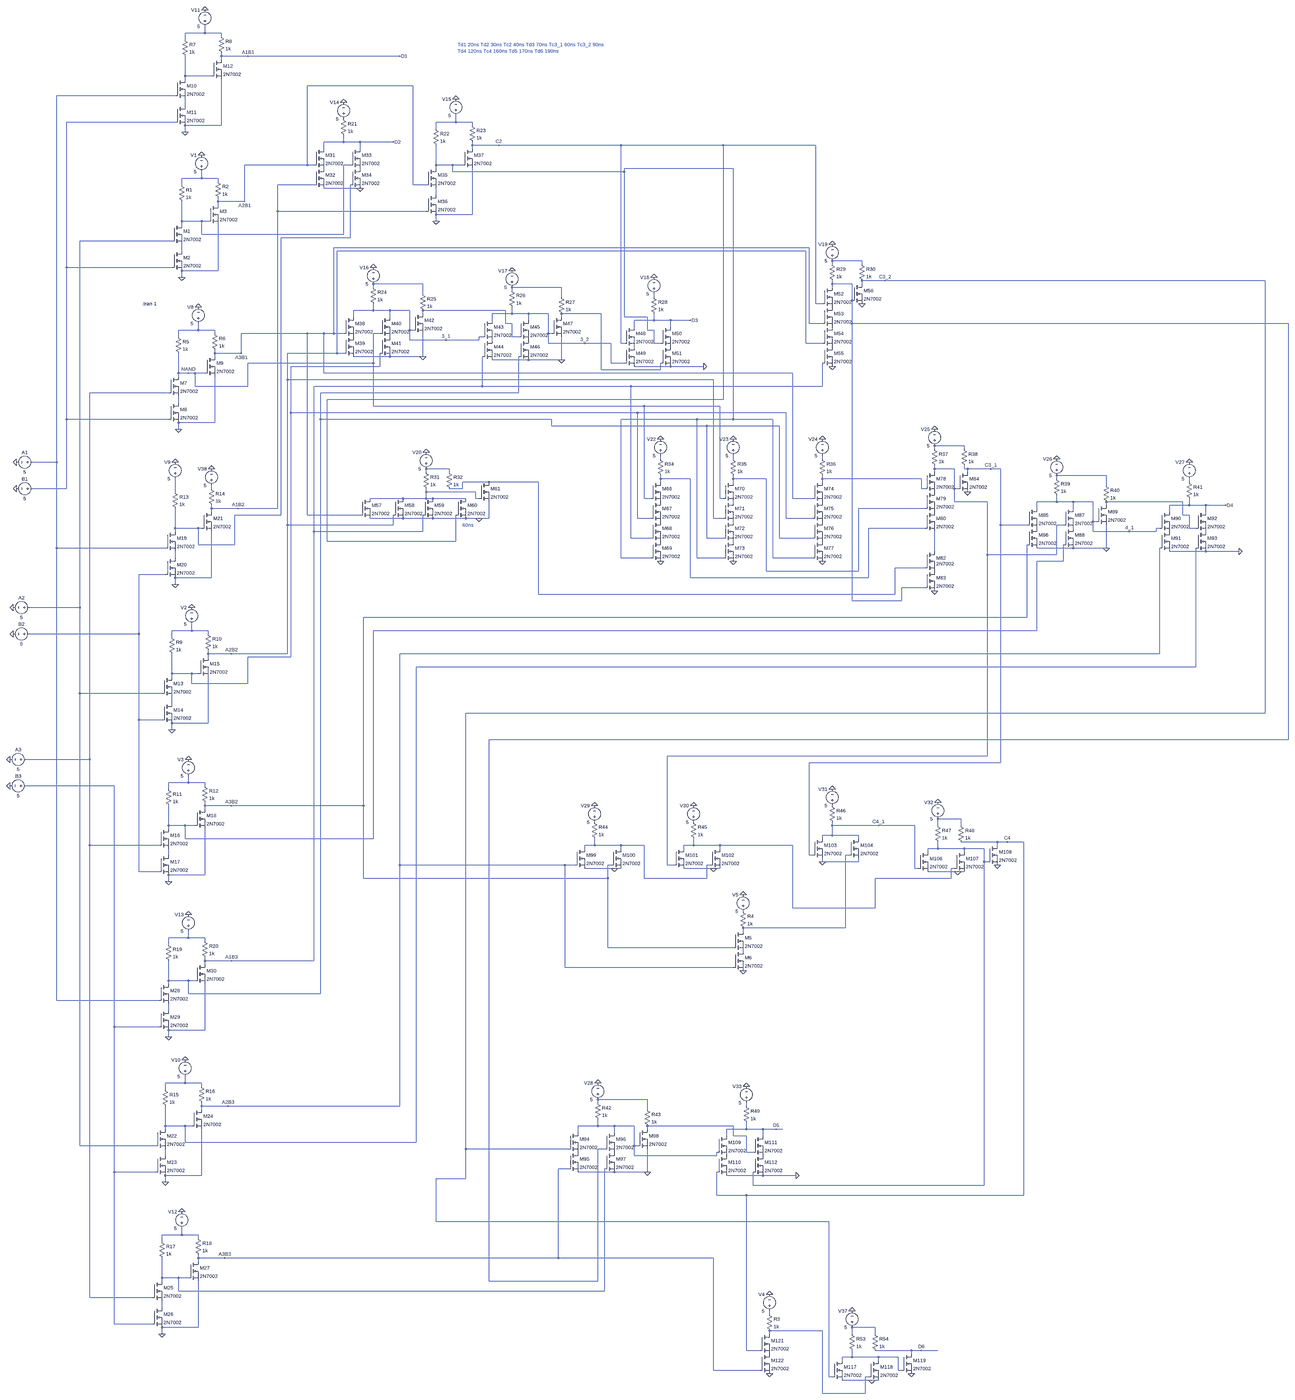
[diagram p0: schematic MOSFET Testing.asc, whole sheet]
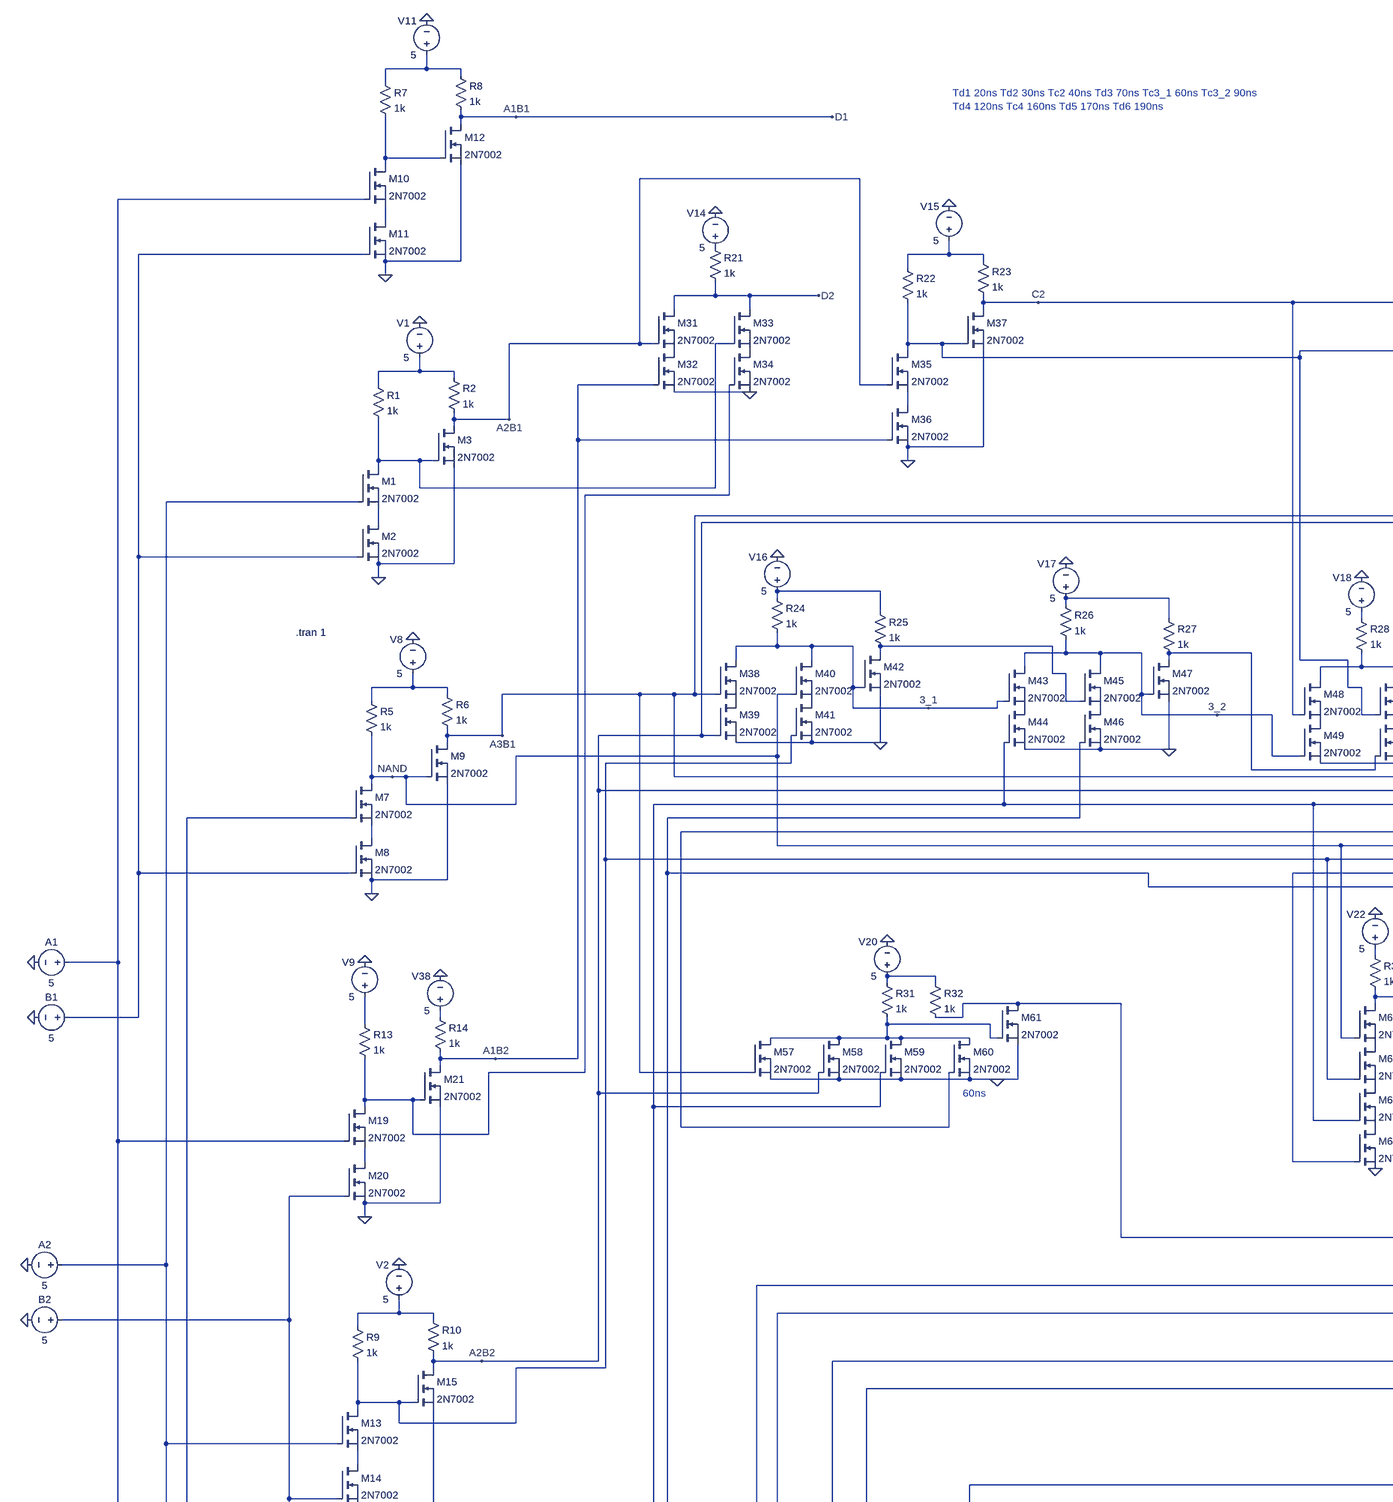
[diagram p1: schematic MOSFET Testing.asc, part, row 1 of 2, column 1 of 2]
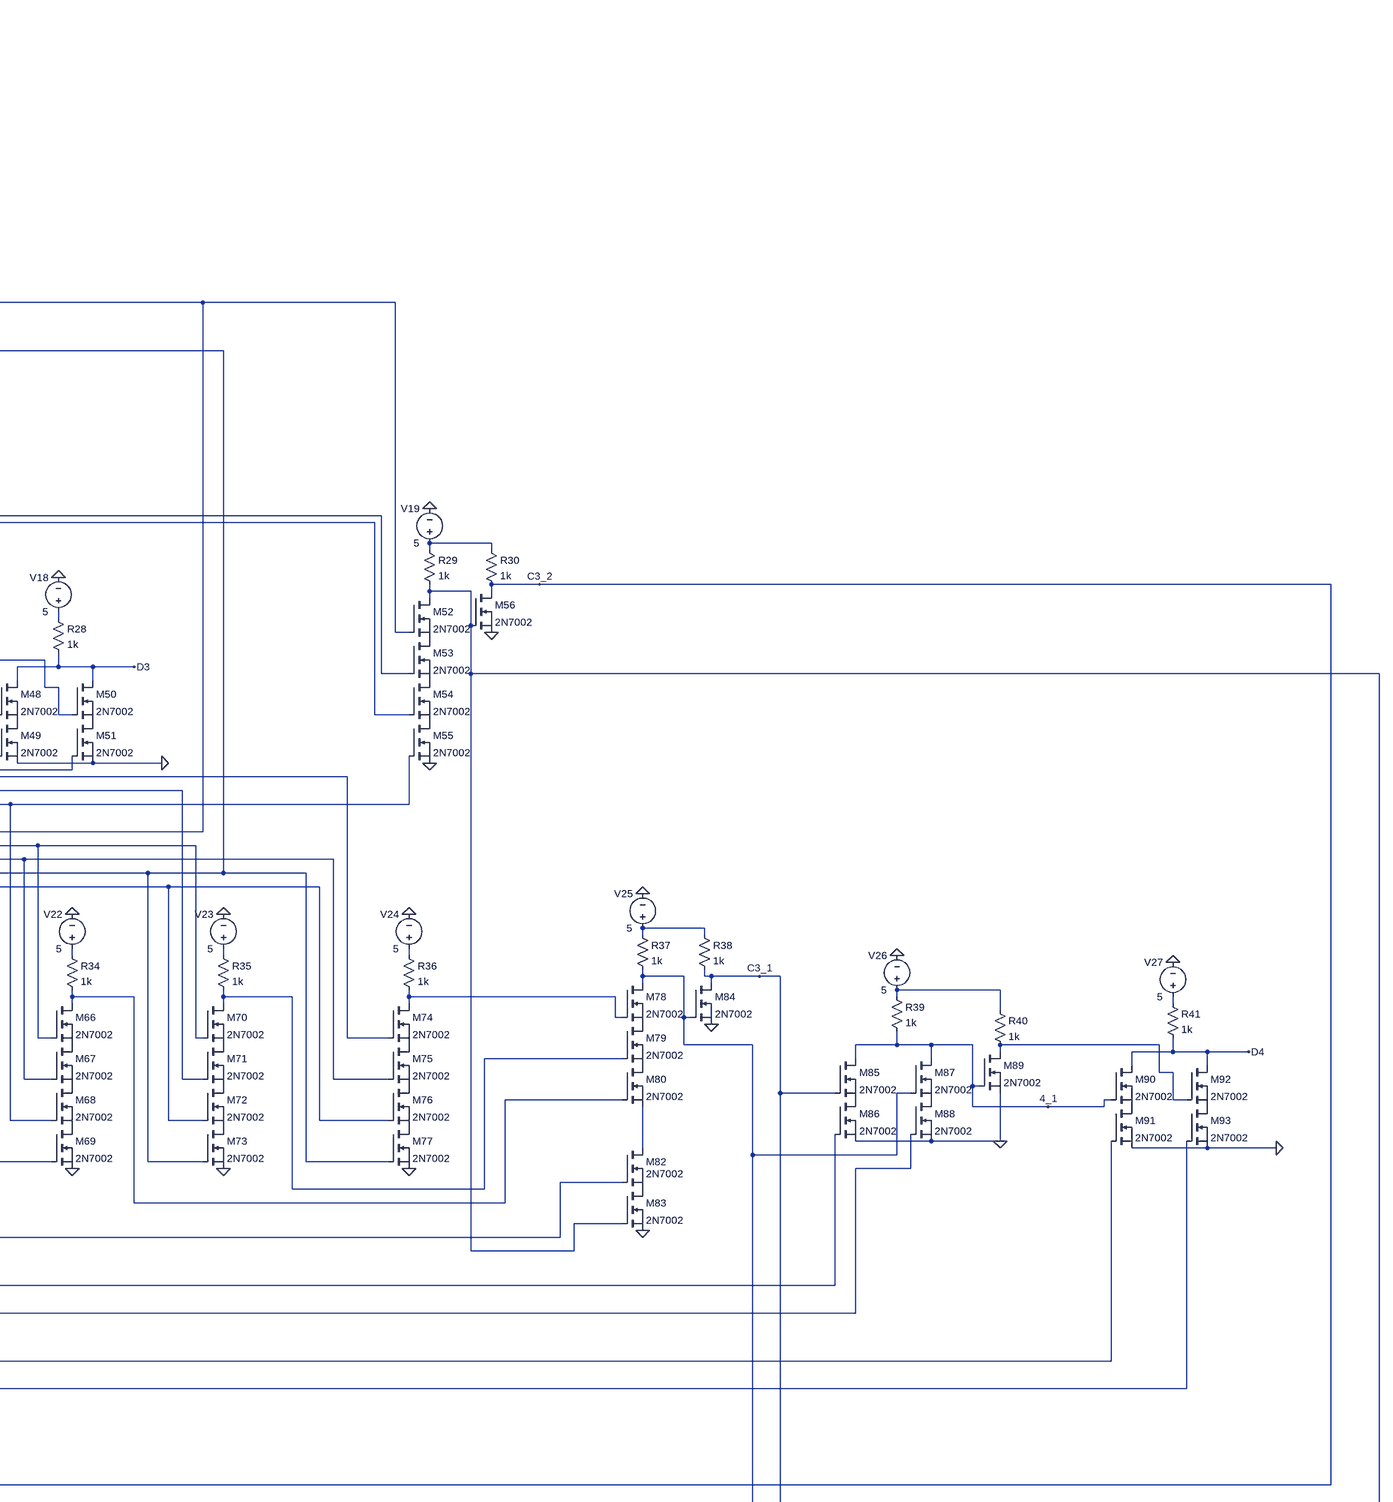
[diagram p2: schematic MOSFET Testing.asc, part, row 1 of 2, column 2 of 2]
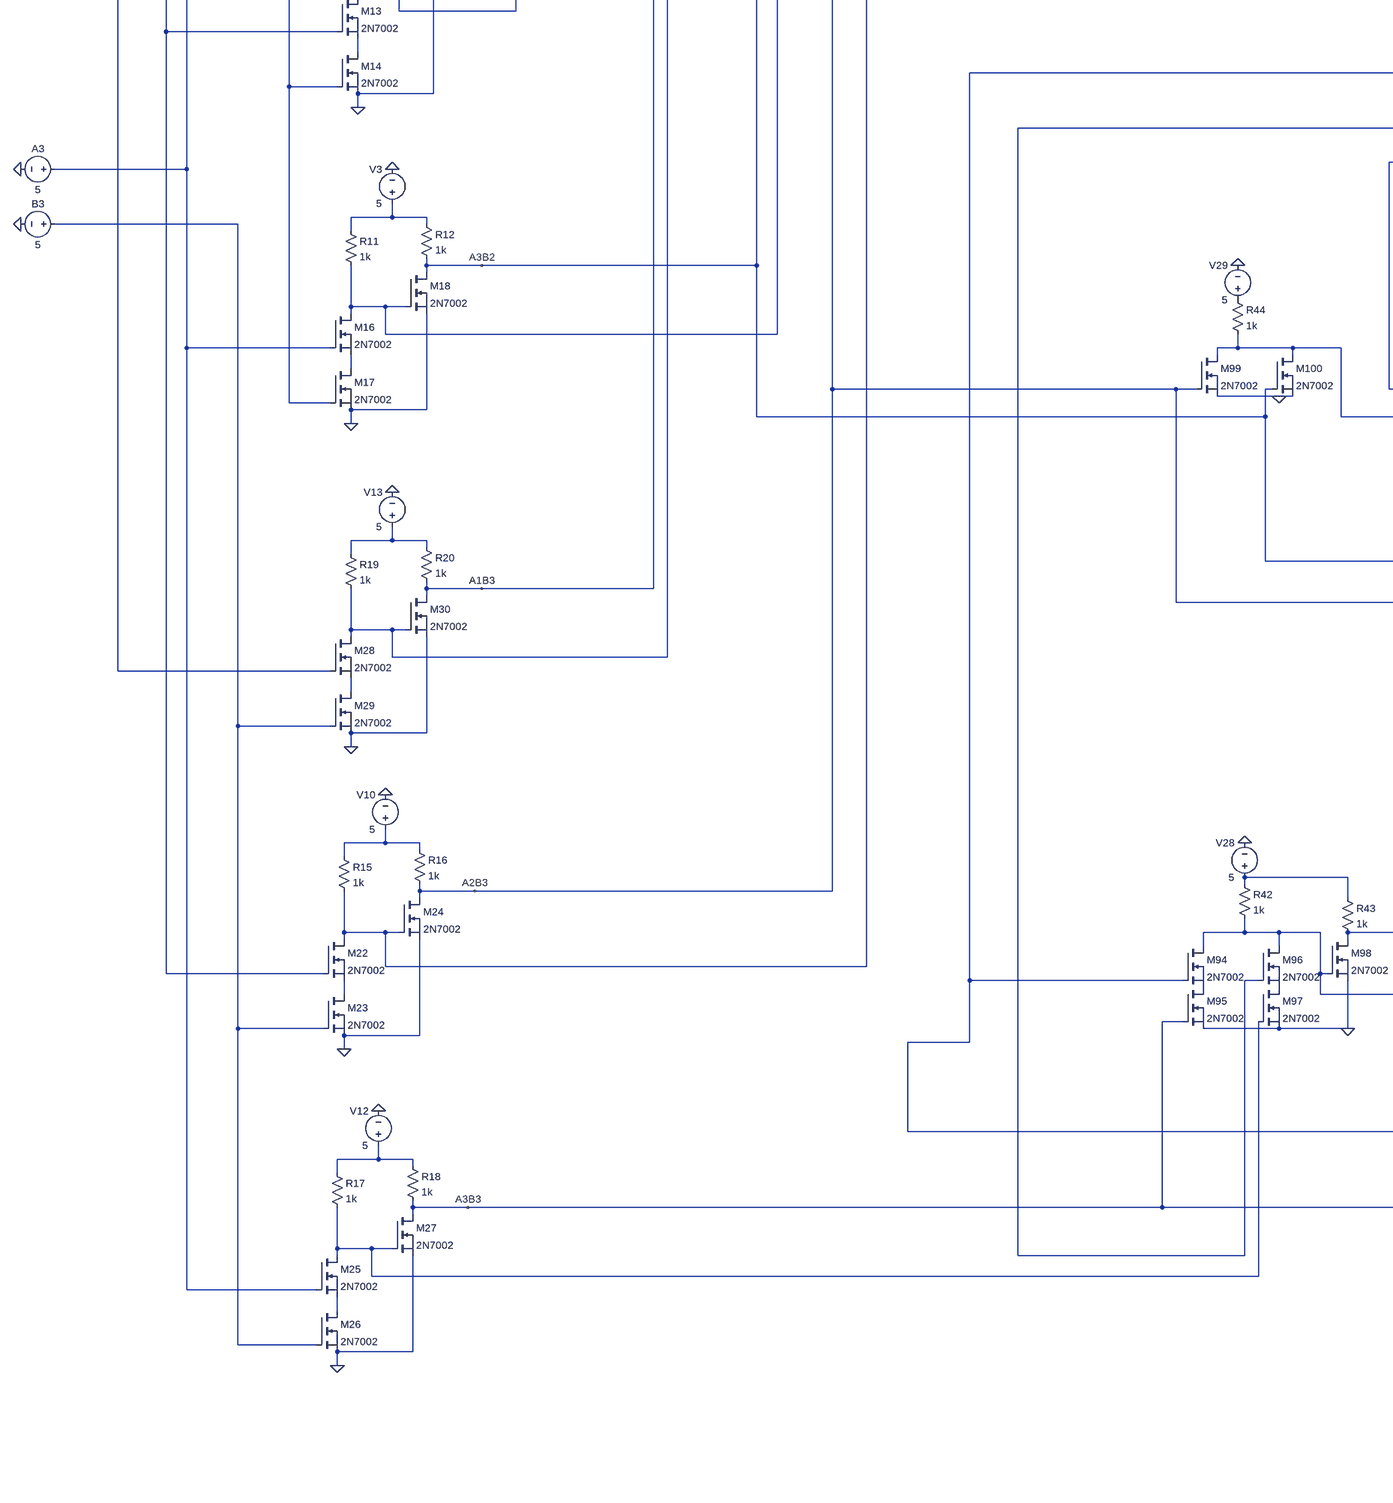
[diagram p3: schematic MOSFET Testing.asc, part, row 2 of 2, column 1 of 2]
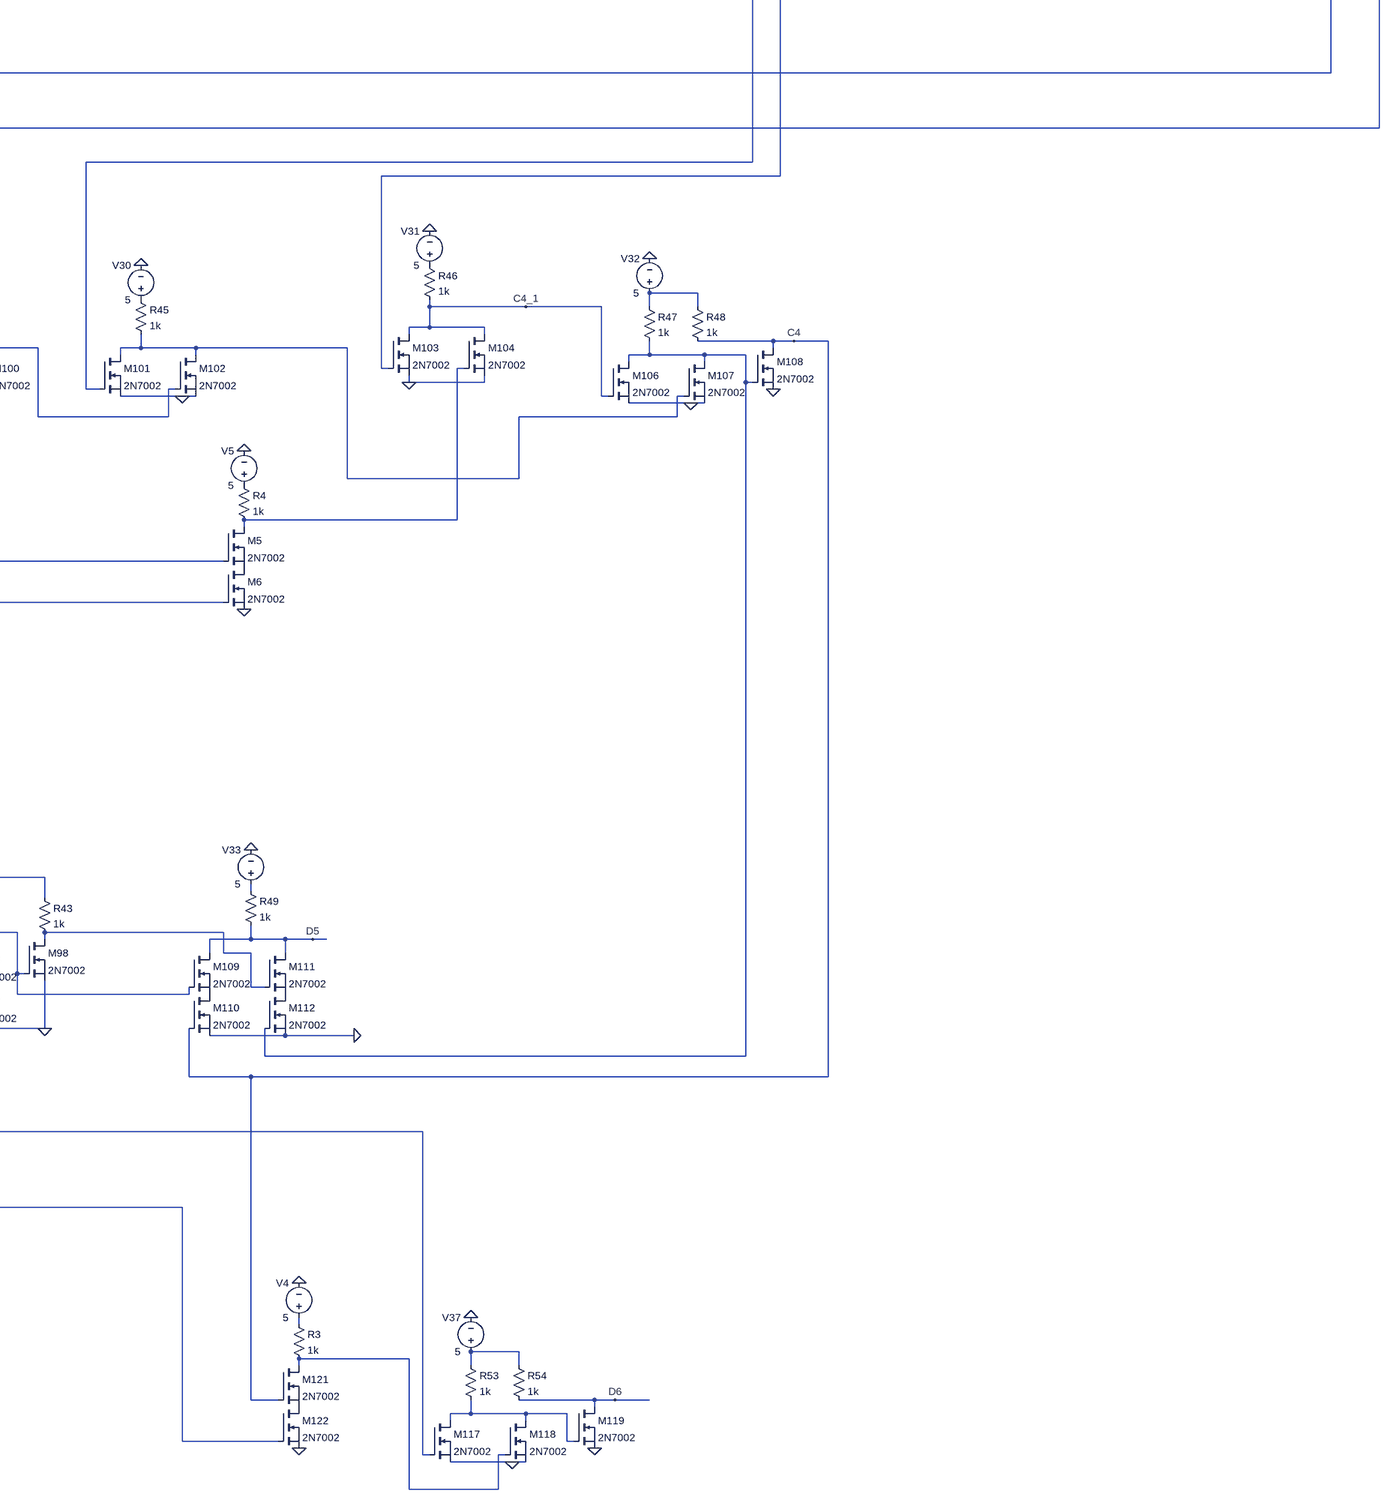
[diagram p4: schematic MOSFET Testing.asc, part, row 2 of 2, column 2 of 2]
MOSFET Testing.asc, the LTspice schematic file:
Version 4
SHEET 1 5524 6260
WIRE -96 -784 -96 -816
WIRE -96 -784 -192 -784
WIRE -16 -784 -96 -784
WIRE -16 -768 -16 -784
WIRE -192 -752 -192 -784
WIRE -16 -672 -16 -688
WIRE 112 -672 -16 -672
WIRE 960 -672 112 -672
WIRE -16 -656 -16 -672
WIRE -192 -576 -192 -672
WIRE -64 -576 -192 -576
WIRE -192 -560 -192 -576
WIRE 1024 -528 512 -528
WIRE -240 -480 -832 -480
WIRE -192 -432 -192 -464
WIRE -240 -352 -784 -352
WIRE 1232 -352 1232 -384
WIRE 1232 -352 1136 -352
WIRE 1312 -352 1232 -352
WIRE -16 -336 -16 -560
WIRE -16 -336 -192 -336
WIRE 1312 -336 1312 -352
WIRE 1136 -320 1136 -352
WIRE -192 -304 -192 -336
WIRE 688 -256 688 -288
WIRE 688 -256 592 -256
WIRE 768 -256 688 -256
WIRE 928 -256 768 -256
WIRE 1312 -240 1312 -256
WIRE 1440 -240 1312 -240
WIRE 2032 -240 1440 -240
WIRE 2528 -240 2032 -240
WIRE 2976 -240 2528 -240
WIRE 592 -224 592 -256
WIRE 768 -224 768 -256
WIRE 1312 -224 1312 -240
WIRE 512 -144 512 -528
WIRE 512 -144 96 -144
WIRE 544 -144 512 -144
WIRE 720 -144 688 -144
WIRE 1136 -144 1136 -240
WIRE 1216 -144 1136 -144
WIRE 1264 -144 1216 -144
WIRE 1136 -128 1136 -144
WIRE 2576 -128 2048 -128
WIRE 1216 -112 1216 -144
WIRE 2048 -112 2048 -128
WIRE 2048 -112 1216 -112
WIRE -112 -80 -112 -112
WIRE -112 -80 -208 -80
WIRE -32 -80 -112 -80
WIRE -32 -64 -32 -80
WIRE -208 -48 -208 -80
WIRE 544 -48 368 -48
WIRE 1024 -48 1024 -528
WIRE 1088 -48 1024 -48
WIRE 768 -32 592 -32
WIRE 1136 0 1136 -32
WIRE -32 32 -32 16
WIRE 96 32 96 -144
WIRE 96 32 -32 32
WIRE -32 48 -32 32
WIRE 368 80 368 -48
WIRE 1088 80 368 80
WIRE 1312 96 1312 -128
WIRE 1312 96 1136 96
WIRE -208 128 -208 32
WIRE -112 128 -208 128
WIRE -80 128 -112 128
WIRE 1136 128 1136 96
WIRE -208 144 -208 128
WIRE -112 192 -112 128
WIRE 688 192 688 -144
WIRE 688 192 -112 192
WIRE 720 208 720 -48
WIRE 720 208 384 208
WIRE -256 224 -720 224
WIRE 2944 256 640 256
WIRE -208 272 -208 240
WIRE 2928 272 656 272
WIRE 3200 320 3056 320
WIRE 3056 336 3056 320
WIRE 3200 336 3200 320
WIRE -784 352 -784 -352
WIRE -256 352 -784 352
WIRE -32 368 -32 144
WIRE -32 368 -208 368
WIRE -208 400 -208 368
WIRE 3312 416 3200 416
WIRE 5344 416 3312 416
WIRE 1072 432 832 432
WIRE 3056 432 3056 416
WIRE 3152 432 3056 432
WIRE 3200 432 3200 416
WIRE 832 448 832 432
WIRE 1744 448 1504 448
WIRE 3056 448 3056 432
WIRE 1504 464 1504 448
WIRE 1072 480 1072 432
WIRE 1744 496 1744 448
WIRE 2192 496 2192 480
WIRE 3152 512 3152 432
WIRE 2976 528 2976 -240
WIRE 3008 528 2976 528
WIRE 832 560 832 528
WIRE 832 560 736 560
WIRE 912 560 832 560
WIRE 1008 560 912 560
WIRE 1472 560 1072 560
WIRE 1072 576 1072 560
WIRE 1504 576 1504 544
WIRE 1504 576 1408 576
WIRE 1584 576 1504 576
WIRE 1680 576 1584 576
WIRE 1936 576 1744 576
WIRE 736 592 736 560
WIRE 912 592 912 560
WIRE 1744 592 1744 576
WIRE 2048 592 2048 -112
WIRE 2160 592 2048 592
WIRE 1408 608 1408 576
WIRE 1584 608 1584 576
WIRE 2192 608 2192 576
WIRE 2192 608 2096 608
WIRE 2272 608 2192 608
WIRE 2368 608 2272 608
WIRE 1472 624 1472 560
WIRE 1504 624 1472 624
WIRE 2944 624 2944 256
WIRE 3008 624 2944 624
WIRE 3152 624 3152 512
WIRE 5520 624 3152 624
WIRE 2096 640 2096 608
WIRE 2272 640 2272 608
WIRE -128 656 -128 624
WIRE -128 656 -224 656
WIRE -48 656 -128 656
WIRE 1008 656 1008 560
WIRE 1024 656 1008 656
WIRE 2160 656 2160 592
WIRE 2192 656 2160 656
WIRE -48 672 -48 656
WIRE 512 672 80 672
WIRE 592 672 512 672
WIRE 640 672 640 256
WIRE 640 672 592 672
WIRE 688 672 640 672
WIRE 864 672 832 672
WIRE 1680 672 1680 576
WIRE 1696 672 1680 672
WIRE -224 688 -224 656
WIRE 1360 688 1344 688
WIRE 1504 688 1504 624
WIRE 1536 688 1504 688
WIRE 1008 704 1008 656
WIRE 1184 704 1008 704
WIRE 1344 704 1344 688
WIRE 1344 704 1184 704
WIRE 1680 720 1680 672
WIRE 1856 720 1680 720
WIRE 1984 720 1856 720
WIRE 2032 720 2032 -240
WIRE 2048 720 2032 720
WIRE 2192 720 2192 656
WIRE 2224 720 2192 720
WIRE 2928 720 2928 272
WIRE 3008 720 2928 720
WIRE -48 768 -48 752
WIRE 80 768 80 672
WIRE 80 768 -48 768
WIRE 656 768 656 272
WIRE 656 768 416 768
WIRE 688 768 656 768
WIRE -48 784 -48 768
WIRE 912 784 736 784
WIRE 1072 784 1072 672
WIRE 1072 784 912 784
WIRE 1584 800 1408 800
WIRE 1744 800 1744 688
WIRE 1744 800 1584 800
WIRE 832 816 832 672
WIRE 832 816 112 816
WIRE 1984 816 1984 720
WIRE 2048 816 1984 816
WIRE 864 832 864 768
WIRE 864 832 432 832
WIRE 2272 832 2096 832
WIRE 2432 832 2272 832
WIRE 1936 848 1936 576
WIRE 2224 848 2224 816
WIRE 2224 848 1936 848
WIRE -224 864 -224 768
WIRE -176 864 -224 864
WIRE -144 864 -176 864
WIRE -96 864 -144 864
WIRE 592 864 592 672
WIRE 2864 864 592 864
WIRE -224 880 -224 864
WIRE 416 896 416 768
WIRE 2480 896 416 896
WIRE -144 928 -144 864
WIRE 112 928 112 816
WIRE 112 928 -144 928
WIRE 1360 928 1360 784
WIRE 1360 928 544 928
WIRE 2080 928 1360 928
WIRE 3008 928 3008 816
WIRE 3008 928 2080 928
WIRE -272 960 -672 960
WIRE 1536 960 1536 784
WIRE 1536 960 576 960
WIRE 2528 992 2528 -240
WIRE 2528 992 608 992
WIRE -224 1008 -224 976
WIRE 832 1024 832 816
WIRE 2144 1024 832 1024
WIRE 2512 1024 2144 1024
WIRE 432 1056 432 832
WIRE 2112 1056 432 1056
WIRE 2832 1056 2112 1056
WIRE -784 1088 -784 352
WIRE -272 1088 -784 1088
WIRE 576 1088 576 960
WIRE 1696 1088 576 1088
WIRE 2400 1088 2032 1088
WIRE 2576 1088 2576 -128
WIRE 2576 1088 2400 1088
WIRE 2768 1088 2576 1088
WIRE -48 1104 -48 880
WIRE -48 1104 -224 1104
WIRE 1696 1120 1696 1088
WIRE 2448 1120 1696 1120
WIRE 2800 1120 2448 1120
WIRE -224 1136 -224 1104
WIRE 3696 1216 3552 1216
WIRE 3552 1232 3552 1216
WIRE 3696 1232 3696 1216
WIRE 2224 1280 2224 1264
WIRE 2576 1280 2576 1264
WIRE 3008 1280 3008 1264
WIRE -832 1296 -832 -480
WIRE -832 1296 -1472 1296
WIRE 1200 1328 1088 1328
WIRE 3552 1328 3552 1312
WIRE 3648 1328 3552 1328
WIRE 3696 1328 3696 1312
WIRE 3712 1328 3696 1328
WIRE 3824 1328 3712 1328
WIRE 3872 1328 3824 1328
WIRE 1088 1344 1088 1328
WIRE 1200 1344 1200 1328
WIRE 3552 1344 3552 1328
WIRE 3712 1344 3712 1328
WIRE 4384 1360 4144 1360
WIRE 2224 1376 2224 1360
WIRE 2368 1376 2224 1376
WIRE 2576 1376 2576 1360
WIRE 2736 1376 2576 1376
WIRE 3008 1376 3008 1360
WIRE 3488 1376 3008 1376
WIRE 4144 1376 4144 1360
WIRE 1392 1392 1264 1392
WIRE 1632 1392 1392 1392
WIRE 2224 1392 2224 1376
WIRE 2576 1392 2576 1376
WIRE 3008 1392 3008 1376
WIRE 4816 1392 4816 1376
WIRE 4384 1408 4384 1360
WIRE -784 1424 -784 1088
WIRE -784 1424 -1472 1424
WIRE -64 1424 -64 1408
WIRE 1264 1424 1264 1392
WIRE 1264 1424 1200 1424
WIRE 3488 1424 3488 1376
WIRE 3504 1424 3488 1424
WIRE 3648 1424 3648 1328
WIRE 3664 1424 3648 1424
WIRE -240 1440 -240 1376
WIRE 1088 1440 1088 1424
WIRE 1328 1440 1088 1440
WIRE 976 1472 816 1472
WIRE 1088 1472 1088 1440
WIRE 1088 1472 976 1472
WIRE 1120 1472 1088 1472
WIRE 1280 1472 1120 1472
WIRE 1328 1472 1328 1440
WIRE 1344 1472 1328 1472
WIRE 2144 1472 2144 1024
WIRE 2176 1472 2144 1472
WIRE 2512 1472 2512 1024
WIRE 2528 1472 2512 1472
WIRE 2864 1472 2864 864
WIRE 2960 1472 2864 1472
WIRE 3648 1488 3648 1424
WIRE 3808 1488 3648 1488
WIRE 4144 1488 4144 1456
WIRE 4144 1488 4048 1488
WIRE 4224 1488 4144 1488
WIRE 4320 1488 4224 1488
WIRE 4784 1488 4384 1488
WIRE 4384 1504 4384 1488
WIRE 4816 1504 4816 1472
WIRE 4816 1504 4720 1504
WIRE 4896 1504 4816 1504
WIRE 4992 1504 4896 1504
WIRE -64 1520 -64 1504
WIRE 64 1520 -64 1520
WIRE 368 1520 368 80
WIRE 368 1520 64 1520
WIRE 3504 1520 3184 1520
WIRE 4048 1520 4048 1488
WIRE 4224 1520 4224 1488
WIRE -64 1536 -64 1520
WIRE 4720 1536 4720 1504
WIRE 4896 1536 4896 1504
WIRE 384 1552 384 208
WIRE 384 1552 48 1552
WIRE 512 1552 512 672
WIRE 768 1552 512 1552
WIRE 4784 1552 4784 1488
WIRE 4816 1552 4784 1552
WIRE 976 1568 816 1568
WIRE 1120 1568 976 1568
WIRE 1280 1568 1120 1568
WIRE 1344 1568 1280 1568
WIRE 1392 1568 1392 1488
WIRE 1392 1568 1344 1568
WIRE 2112 1568 2112 1056
WIRE 2176 1568 2112 1568
WIRE 2480 1568 2480 896
WIRE 2528 1568 2480 1568
WIRE 2832 1568 2832 1056
WIRE 2960 1568 2832 1568
WIRE 4320 1584 4320 1488
WIRE 4336 1584 4320 1584
WIRE 416 1600 416 896
WIRE 928 1600 928 1552
WIRE 928 1600 416 1600
WIRE 3872 1600 3872 1328
WIRE 4000 1600 3872 1600
WIRE 4176 1600 4144 1600
WIRE -240 1616 -240 1520
WIRE -128 1616 -240 1616
WIRE -112 1616 -128 1616
WIRE 3504 1616 3232 1616
WIRE 4672 1616 4656 1616
WIRE 4816 1616 4816 1552
WIRE 4848 1616 4816 1616
WIRE -240 1632 -240 1616
WIRE 544 1632 544 928
WIRE 1072 1632 1072 1552
WIRE 1072 1632 544 1632
WIRE 4320 1632 4320 1584
WIRE 4496 1632 4320 1632
WIRE 4656 1632 4656 1616
WIRE 4656 1632 4496 1632
WIRE 2080 1664 2080 928
WIRE 2176 1664 2080 1664
WIRE 2448 1664 2448 1120
WIRE 2528 1664 2448 1664
WIRE 2800 1664 2800 1120
WIRE 2960 1664 2800 1664
WIRE 608 1680 608 992
WIRE 1232 1680 1232 1552
WIRE 1232 1680 608 1680
WIRE -128 1696 -128 1616
WIRE 48 1696 48 1552
WIRE 48 1696 -128 1696
WIRE -832 1712 -832 1296
WIRE -288 1712 -832 1712
WIRE 4224 1712 4048 1712
WIRE 4384 1712 4384 1600
WIRE 4384 1712 4224 1712
WIRE 3552 1728 3552 1632
WIRE 4896 1728 4720 1728
WIRE 5056 1728 4896 1728
WIRE 3808 1744 3808 1488
WIRE 4144 1744 4144 1600
WIRE 4144 1744 3808 1744
WIRE -240 1760 -240 1728
WIRE 2032 1760 2032 1088
WIRE 2176 1760 2032 1760
WIRE 2400 1760 2400 1088
WIRE 2528 1760 2400 1760
WIRE 2768 1760 2768 1088
WIRE 2960 1760 2768 1760
WIRE 4176 1776 4176 1696
WIRE 4176 1776 4048 1776
WIRE 3504 1808 3360 1808
WIRE 2736 1824 2736 1376
WIRE 3184 1824 3184 1520
WIRE 3184 1824 2736 1824
WIRE -288 1840 -416 1840
WIRE -64 1856 -64 1632
WIRE -64 1856 -240 1856
WIRE 2368 1856 2368 1376
WIRE 3232 1856 3232 1616
WIRE 3232 1856 2368 1856
WIRE -240 1888 -240 1856
WIRE 3504 1904 3392 1904
WIRE 1632 1936 1632 1392
WIRE 3360 1936 3360 1808
WIRE 3360 1936 1632 1936
WIRE 3152 1968 3152 624
WIRE 3392 1968 3392 1904
WIRE 3392 1968 3152 1968
WIRE -720 2000 -720 224
WIRE -720 2000 -1488 2000
WIRE 4000 2048 4000 1696
WIRE 4000 2048 784 2048
WIRE -160 2112 -160 2080
WIRE -160 2112 -256 2112
WIRE -80 2112 -160 2112
WIRE 4048 2112 4048 1776
WIRE 4048 2112 832 2112
WIRE -416 2128 -416 1840
WIRE -416 2128 -1488 2128
WIRE -80 2128 -80 2112
WIRE -256 2144 -256 2112
WIRE -80 2224 -80 2208
WIRE 32 2224 -80 2224
WIRE 416 2224 416 1600
WIRE 416 2224 32 2224
WIRE 4672 2224 4672 1712
WIRE 4672 2224 960 2224
WIRE -80 2240 -80 2224
WIRE 432 2240 432 1056
WIRE 432 2240 112 2240
WIRE 4848 2288 4848 1712
WIRE 4848 2288 1040 2288
WIRE -256 2320 -256 2224
WIRE -160 2320 -256 2320
WIRE -128 2320 -160 2320
WIRE -256 2336 -256 2320
WIRE -160 2368 -160 2320
WIRE 112 2368 112 2240
WIRE 112 2368 -160 2368
WIRE -720 2416 -720 2000
WIRE -304 2416 -720 2416
WIRE -256 2464 -256 2432
WIRE 5344 2512 5344 416
WIRE 5344 2512 1280 2512
WIRE -416 2544 -416 2128
WIRE -304 2544 -416 2544
WIRE -80 2560 -80 2336
WIRE -80 2560 -256 2560
WIRE -256 2592 -256 2560
WIRE 5520 2640 5520 624
WIRE 5520 2640 1392 2640
WIRE 3808 2720 3808 1744
WIRE 3808 2720 2256 2720
WIRE -672 2736 -672 960
WIRE -672 2736 -1504 2736
WIRE 3872 2752 3872 1600
WIRE 3872 2752 2944 2752
WIRE -176 2848 -176 2816
WIRE -176 2848 -272 2848
WIRE -96 2848 -176 2848
WIRE -544 2864 -1504 2864
WIRE -96 2864 -96 2848
WIRE -272 2880 -272 2848
WIRE -96 2960 -96 2944
WIRE 32 2960 -96 2960
WIRE 784 2960 784 2048
WIRE 784 2960 32 2960
WIRE -96 2976 -96 2960
WIRE 3680 3024 3568 3024
WIRE -272 3056 -272 2960
WIRE -192 3056 -272 3056
WIRE -144 3056 -192 3056
WIRE 3056 3056 3056 3040
WIRE 3280 3056 3056 3056
WIRE 3456 3056 3280 3056
WIRE 3568 3056 3568 3024
WIRE 3680 3056 3680 3024
WIRE -272 3072 -272 3056
WIRE 3056 3104 3056 3056
WIRE 3056 3104 3008 3104
WIRE 3184 3104 3056 3104
WIRE -192 3120 -192 3056
WIRE 832 3120 832 2112
WIRE 832 3120 -192 3120
WIRE 3008 3120 3008 3104
WIRE 3184 3120 3184 3104
WIRE 3856 3136 3680 3136
WIRE 3904 3136 3856 3136
WIRE 3984 3136 3904 3136
WIRE -672 3152 -672 2736
WIRE -320 3152 -672 3152
WIRE 1904 3152 1904 3120
WIRE 1904 3152 1856 3152
WIRE 2032 3152 1904 3152
WIRE 2144 3152 2032 3152
WIRE 2384 3152 2384 3120
WIRE 2384 3152 2336 3152
WIRE 2512 3152 2384 3152
WIRE 2864 3152 2512 3152
WIRE 3856 3152 3856 3136
WIRE 1856 3168 1856 3152
WIRE 2032 3168 2032 3152
WIRE 2336 3168 2336 3152
WIRE 2512 3168 2512 3152
WIRE 3568 3168 3568 3136
WIRE 3568 3168 3520 3168
WIRE 3696 3168 3568 3168
WIRE 3792 3168 3696 3168
WIRE 3520 3184 3520 3168
WIRE 3696 3184 3696 3168
WIRE -272 3200 -272 3168
WIRE 2944 3200 2944 2752
WIRE 2960 3200 2944 3200
WIRE 3136 3200 3120 3200
WIRE 3008 3232 3008 3216
WIRE 3184 3232 3184 3216
WIRE 3184 3232 3008 3232
WIRE 3792 3232 3792 3168
WIRE 3808 3232 3792 3232
WIRE 960 3248 960 2224
WIRE 1760 3248 960 3248
WIRE 1808 3248 1760 3248
WIRE 1984 3248 1968 3248
WIRE 2256 3248 2256 2720
WIRE 2288 3248 2256 3248
WIRE 2464 3248 2448 3248
WIRE 2000 3264 1856 3264
WIRE 2032 3264 2000 3264
WIRE 2480 3264 2336 3264
WIRE 2512 3264 2480 3264
WIRE 3456 3264 3456 3056
WIRE 3472 3264 3456 3264
WIRE 3648 3264 3632 3264
WIRE -416 3280 -416 2544
WIRE -320 3280 -416 3280
WIRE 3664 3280 3520 3280
WIRE 3696 3280 3664 3280
WIRE -96 3296 -96 3072
WIRE -96 3296 -272 3296
WIRE 784 3312 784 2960
WIRE 1968 3312 1968 3248
WIRE 1968 3312 784 3312
WIRE 2144 3312 2144 3152
WIRE 2448 3312 2448 3248
WIRE 2448 3312 2144 3312
WIRE 3632 3312 3632 3264
WIRE 3632 3312 3264 3312
WIRE -272 3328 -272 3296
WIRE 2864 3456 2864 3152
WIRE 3264 3456 3264 3312
WIRE 3264 3456 2864 3456
WIRE 3120 3552 3120 3200
WIRE 3120 3552 2624 3552
WIRE 2624 3568 2624 3552
WIRE -176 3600 -176 3568
WIRE -176 3600 -272 3600
WIRE -96 3600 -176 3600
WIRE -96 3616 -96 3600
WIRE -272 3632 -272 3600
WIRE 1968 3648 1968 3312
WIRE 2576 3648 1968 3648
WIRE -96 3712 -96 3696
WIRE 32 3712 -96 3712
WIRE 544 3712 544 1632
WIRE 544 3712 32 3712
WIRE -96 3728 -96 3712
WIRE 1760 3744 1760 3248
WIRE 2576 3744 1760 3744
WIRE -272 3808 -272 3712
WIRE -176 3808 -272 3808
WIRE -144 3808 -176 3808
WIRE -272 3824 -272 3808
WIRE -176 3872 -176 3808
WIRE 576 3872 576 1088
WIRE 576 3872 -176 3872
WIRE -832 3904 -832 1712
WIRE -320 3904 -832 3904
WIRE -272 3952 -272 3920
WIRE -544 4032 -544 2864
WIRE -320 4032 -544 4032
WIRE -96 4048 -96 3824
WIRE -96 4048 -272 4048
WIRE -272 4080 -272 4048
WIRE -192 4304 -192 4272
WIRE -192 4304 -288 4304
WIRE -112 4304 -192 4304
WIRE -112 4320 -112 4304
WIRE -288 4336 -288 4304
WIRE 2160 4384 1920 4384
WIRE 1920 4400 1920 4384
WIRE -112 4416 -112 4400
WIRE 16 4416 -112 4416
WIRE 960 4416 960 3248
WIRE 960 4416 16 4416
WIRE 2640 4416 2640 4400
WIRE -112 4432 -112 4416
WIRE 2160 4432 2160 4384
WIRE -288 4512 -288 4416
WIRE -192 4512 -288 4512
WIRE -160 4512 -192 4512
WIRE 1920 4512 1920 4480
WIRE 1920 4512 1824 4512
WIRE 2000 4512 1920 4512
WIRE 2096 4512 2000 4512
WIRE 2576 4512 2160 4512
WIRE -288 4528 -288 4512
WIRE 2160 4528 2160 4512
WIRE 2640 4528 2640 4496
WIRE 2640 4528 2544 4528
WIRE 2720 4528 2640 4528
WIRE 2784 4528 2720 4528
WIRE 2816 4528 2784 4528
WIRE 1824 4544 1824 4512
WIRE 2000 4544 2000 4512
WIRE 2544 4560 2544 4528
WIRE 2576 4560 2576 4512
WIRE 2640 4560 2576 4560
WIRE 2720 4560 2720 4528
WIRE -192 4592 -192 4512
WIRE 1040 4592 1040 2288
WIRE 1040 4592 -192 4592
WIRE -720 4608 -720 2416
WIRE -336 4608 -720 4608
WIRE 2096 4608 2096 4512
WIRE 2112 4608 2096 4608
WIRE 1280 4624 1280 2512
WIRE 1776 4624 1280 4624
WIRE 1952 4624 1920 4624
WIRE 2640 4640 2640 4560
WIRE 2672 4640 2640 4640
WIRE -288 4656 -288 4624
WIRE 2096 4656 2096 4608
WIRE 2496 4656 2496 4640
WIRE 2496 4656 2096 4656
WIRE 1776 4720 1728 4720
WIRE -544 4736 -544 4032
WIRE -336 4736 -544 4736
WIRE 2000 4736 1824 4736
WIRE 2160 4736 2160 4624
WIRE 2160 4736 2000 4736
WIRE -112 4752 -112 4528
WIRE -112 4752 -288 4752
WIRE 2720 4752 2544 4752
WIRE 2880 4752 2720 4752
WIRE 1280 4768 1280 4624
WIRE 1280 4768 1136 4768
WIRE -288 4784 -288 4752
WIRE 2672 4800 2672 4736
WIRE 3792 4800 3792 3232
WIRE 3792 4800 2672 4800
WIRE 2496 4848 2496 4736
WIRE 2640 4848 2496 4848
WIRE 3984 4848 3984 3136
WIRE 3984 4848 2640 4848
WIRE 1136 4976 1136 4768
WIRE 3040 4976 1136 4976
WIRE -208 5040 -208 5008
WIRE -208 5040 -304 5040
WIRE -128 5040 -208 5040
WIRE -128 5056 -128 5040
WIRE -304 5072 -304 5040
WIRE -128 5152 -128 5136
WIRE 0 5152 -128 5152
WIRE 1728 5152 1728 4720
WIRE 1728 5152 0 5152
WIRE 2480 5152 1728 5152
WIRE -128 5168 -128 5152
WIRE -304 5248 -304 5152
WIRE -224 5248 -304 5248
WIRE -176 5248 -224 5248
WIRE -304 5264 -304 5248
WIRE 1392 5264 1392 2640
WIRE 1920 5264 1920 4624
WIRE 1920 5264 1392 5264
WIRE -224 5312 -224 5248
WIRE 1952 5312 1952 4720
WIRE 1952 5312 -224 5312
WIRE -672 5344 -672 3152
WIRE -352 5344 -672 5344
WIRE -304 5392 -304 5360
WIRE 2752 5424 2752 5408
WIRE -544 5472 -544 4736
WIRE -352 5472 -544 5472
WIRE -128 5488 -128 5264
WIRE -128 5488 -304 5488
WIRE 3264 5488 3152 5488
WIRE 3008 5504 2752 5504
WIRE -304 5520 -304 5488
WIRE 2752 5520 2752 5504
WIRE 3152 5520 3152 5488
WIRE 3264 5520 3264 5488
WIRE 2640 5600 2640 4848
WIRE 2704 5600 2640 5600
WIRE 3440 5600 3264 5600
WIRE 3488 5600 3440 5600
WIRE 3568 5600 3488 5600
WIRE 3440 5616 3440 5600
WIRE 3152 5632 3152 5600
WIRE 3152 5632 3104 5632
WIRE 3280 5632 3152 5632
WIRE 3376 5632 3280 5632
WIRE 3104 5648 3104 5632
WIRE 3280 5648 3280 5632
WIRE 2480 5696 2480 5152
WIRE 2704 5696 2480 5696
WIRE 3376 5696 3376 5632
WIRE 3392 5696 3376 5696
WIRE 3040 5728 3040 4976
WIRE 3056 5728 3040 5728
WIRE 3232 5728 3216 5728
WIRE 3248 5744 3104 5744
WIRE 3280 5744 3248 5744
WIRE 3008 5808 3008 5504
WIRE 3216 5808 3216 5728
WIRE 3216 5808 3008 5808
FLAG -208 400 0
FLAG -1568 2128 0
FLAG -112 -192 0
FLAG 96 32 A2B1
FLAG -224 1136 0
FLAG -176 864 NAND
FLAG -1584 2864 0
FLAG -128 544 0
FLAG 80 768 A3B1
FLAG -192 -304 0
FLAG -1552 1296 0
FLAG -1552 1424 0
FLAG -96 -896 0
FLAG 112 -672 A1B1
FLAG -1568 2000 0
FLAG -1584 2736 0
FLAG -256 2592 0
FLAG -160 2000 0
FLAG 32 2224 A2B2
FLAG -272 3328 0
FLAG -176 2736 0
FLAG 32 2960 A3B2
FLAG -240 1888 0
FLAG -240 1296 0
FLAG 64 1520 A1B2
FLAG -288 4784 0
FLAG -192 4192 0
FLAG 16 4416 A2B3
FLAG -304 5520 0
FLAG -208 4928 0
FLAG 0 5152 A3B3
FLAG -272 4080 0
FLAG -176 3488 0
FLAG 32 3712 A1B3
FLAG 960 -672 D1
FLAG 688 -448 0
FLAG 768 -32 0
FLAG 928 -256 D2
FLAG 1136 128 0
FLAG 1232 -464 0
FLAG 1440 -240 C2
FLAG 832 352 0
FLAG 1072 784 0
FLAG 1184 704 3_1
FLAG 1504 368 0
FLAG 1744 800 0
FLAG 1856 720 3_2
FLAG 2192 400 0
FLAG 2432 832 0
FLAG 2368 608 D3
FLAG 3056 240 0
FLAG 3056 832 0
FLAG 3200 528 0
FLAG 3312 416 C3_2
FLAG 1088 1248 0
FLAG 1344 1568 0
FLAG 2224 1184 0
FLAG 2224 1776 0
FLAG 2576 1184 0
FLAG 2576 1776 0
FLAG 3008 1184 0
FLAG 3008 1776 0
FLAG 3552 1136 0
FLAG 3552 1920 0
FLAG 3712 1440 0
FLAG 3824 1328 C3_1
FLAG 4144 1280 0
FLAG 4384 1712 0
FLAG 4496 1632 4_1
FLAG 4816 1296 0
FLAG 5056 1728 0
FLAG 4992 1504 D4
FLAG 1920 4304 0
FLAG 2160 4736 0
FLAG 1904 2960 0
FLAG 2384 2960 0
FLAG 2480 3264 0
FLAG 3056 2880 0
FLAG 3568 2944 0
FLAG 3664 3280 0
FLAG 3856 3248 0
FLAG 3904 3136 C4
FLAG 2000 3264 0
FLAG 2640 4320 0
FLAG 2880 4752 0
FLAG 2784 4528 D5
FLAG 3152 5408 0
FLAG 3248 5744 0
FLAG 3440 5712 0
FLAG 3488 5600 D6
FLAG -64 1328 0
FLAG 3280 3056 C4_1
FLAG 3008 3232 0
FLAG 2752 5328 0
FLAG 2752 5712 0
FLAG 2624 3760 0
FLAG 2624 3392 0
SYMBOL nmos -256 144 R0
SYMATTR InstName M1
SYMATTR Value 2N7002
SYMBOL res -224 -64 R0
SYMATTR InstName R1
SYMATTR Value 1k
SYMBOL voltage -112 -96 R180
WINDOW 0 24 96 Left 2
WINDOW 3 24 16 Left 2
WINDOW 123 0 0 Left 0
WINDOW 39 0 0 Left 0
SYMATTR InstName V1
SYMATTR Value 5
SYMBOL voltage -1472 2000 R90
WINDOW 0 -32 56 VBottom 2
WINDOW 3 32 56 VTop 2
WINDOW 123 0 0 Left 0
WINDOW 39 0 0 Left 0
SYMATTR InstName A2
SYMATTR Value 5
SYMBOL nmos -256 272 R0
SYMATTR InstName M2
SYMATTR Value 2N7002
SYMBOL voltage -1472 2128 R90
WINDOW 0 -32 56 VBottom 2
WINDOW 3 32 56 VTop 2
WINDOW 123 0 0 Left 0
WINDOW 39 0 0 Left 0
SYMATTR InstName B2
SYMATTR Value 5
SYMBOL nmos -80 48 R0
SYMATTR InstName M3
SYMATTR Value 2N7002
SYMBOL res -48 -80 R0
SYMATTR InstName R2
SYMATTR Value 1k
SYMBOL nmos -272 880 R0
SYMATTR InstName M7
SYMATTR Value 2N7002
SYMBOL res -240 672 R0
SYMATTR InstName R5
SYMATTR Value 1k
SYMBOL voltage -128 640 R180
WINDOW 0 24 96 Left 2
WINDOW 3 24 16 Left 2
WINDOW 123 0 0 Left 0
WINDOW 39 0 0 Left 0
SYMATTR InstName V8
SYMATTR Value 5
SYMBOL voltage -1488 2736 R90
WINDOW 0 -32 56 VBottom 2
WINDOW 3 32 56 VTop 2
WINDOW 123 0 0 Left 0
WINDOW 39 0 0 Left 0
SYMATTR InstName A3
SYMATTR Value 5
SYMBOL nmos -272 1008 R0
SYMATTR InstName M8
SYMATTR Value 2N7002
SYMBOL voltage -1488 2864 R90
WINDOW 0 -32 56 VBottom 2
WINDOW 3 32 56 VTop 2
WINDOW 123 0 0 Left 0
WINDOW 39 0 0 Left 0
SYMATTR InstName B3
SYMATTR Value 5
SYMBOL nmos -96 784 R0
SYMATTR InstName M9
SYMATTR Value 2N7002
SYMBOL res -64 656 R0
SYMATTR InstName R6
SYMATTR Value 1k
SYMBOL nmos -240 -560 R0
SYMATTR InstName M10
SYMATTR Value 2N7002
SYMBOL res -208 -768 R0
SYMATTR InstName R7
SYMATTR Value 1k
SYMBOL voltage -96 -800 R180
WINDOW 0 24 96 Left 2
WINDOW 3 24 16 Left 2
WINDOW 123 0 0 Left 0
WINDOW 39 0 0 Left 0
SYMATTR InstName V11
SYMATTR Value 5
SYMBOL voltage -1456 1296 R90
WINDOW 0 -32 56 VBottom 2
WINDOW 3 32 56 VTop 2
WINDOW 123 0 0 Left 0
WINDOW 39 0 0 Left 0
SYMATTR InstName A1
SYMATTR Value 5
SYMBOL nmos -240 -432 R0
SYMATTR InstName M11
SYMATTR Value 2N7002
SYMBOL voltage -1456 1424 R90
WINDOW 0 -32 56 VBottom 2
WINDOW 3 32 56 VTop 2
WINDOW 123 0 0 Left 0
WINDOW 39 0 0 Left 0
SYMATTR InstName B1
SYMATTR Value 5
SYMBOL nmos -64 -656 R0
SYMATTR InstName M12
SYMATTR Value 2N7002
SYMBOL res -32 -784 R0
SYMATTR InstName R8
SYMATTR Value 1k
SYMBOL nmos -304 2336 R0
SYMATTR InstName M13
SYMATTR Value 2N7002
SYMBOL res -272 2128 R0
SYMATTR InstName R9
SYMATTR Value 1k
SYMBOL voltage -160 2096 R180
WINDOW 0 24 96 Left 2
WINDOW 3 24 16 Left 2
WINDOW 123 0 0 Left 0
WINDOW 39 0 0 Left 0
SYMATTR InstName V2
SYMATTR Value 5
SYMBOL nmos -304 2464 R0
SYMATTR InstName M14
SYMATTR Value 2N7002
SYMBOL nmos -128 2240 R0
SYMATTR InstName M15
SYMATTR Value 2N7002
SYMBOL res -96 2112 R0
SYMATTR InstName R10
SYMATTR Value 1k
SYMBOL nmos -320 3072 R0
SYMATTR InstName M16
SYMATTR Value 2N7002
SYMBOL res -288 2864 R0
SYMATTR InstName R11
SYMATTR Value 1k
SYMBOL voltage -176 2832 R180
WINDOW 0 24 96 Left 2
WINDOW 3 24 16 Left 2
WINDOW 123 0 0 Left 0
WINDOW 39 0 0 Left 0
SYMATTR InstName V3
SYMATTR Value 5
SYMBOL nmos -320 3200 R0
SYMATTR InstName M17
SYMATTR Value 2N7002
SYMBOL nmos -144 2976 R0
SYMATTR InstName M18
SYMATTR Value 2N7002
SYMBOL res -112 2848 R0
SYMATTR InstName R12
SYMATTR Value 1k
SYMBOL nmos -288 1632 R0
SYMATTR InstName M19
SYMATTR Value 2N7002
SYMBOL res -256 1424 R0
SYMATTR InstName R13
SYMATTR Value 1k
SYMBOL voltage -240 1392 R180
WINDOW 0 24 96 Left 2
WINDOW 3 24 16 Left 2
WINDOW 123 0 0 Left 0
WINDOW 39 0 0 Left 0
SYMATTR InstName V9
SYMATTR Value 5
SYMBOL nmos -288 1760 R0
SYMATTR InstName M20
SYMATTR Value 2N7002
SYMBOL nmos -112 1536 R0
SYMATTR InstName M21
SYMATTR Value 2N7002
SYMBOL res -80 1408 R0
SYMATTR InstName R14
SYMATTR Value 1k
SYMBOL nmos -336 4528 R0
SYMATTR InstName M22
SYMATTR Value 2N7002
SYMBOL res -304 4320 R0
SYMATTR InstName R15
SYMATTR Value 1k
SYMBOL voltage -192 4288 R180
WINDOW 0 24 96 Left 2
WINDOW 3 24 16 Left 2
WINDOW 123 0 0 Left 0
WINDOW 39 0 0 Left 0
SYMATTR InstName V10
SYMATTR Value 5
SYMBOL nmos -336 4656 R0
SYMATTR InstName M23
SYMATTR Value 2N7002
SYMBOL nmos -160 4432 R0
SYMATTR InstName M24
SYMATTR Value 2N7002
SYMBOL res -128 4304 R0
SYMATTR InstName R16
SYMATTR Value 1k
SYMBOL nmos -352 5264 R0
SYMATTR InstName M25
SYMATTR Value 2N7002
SYMBOL res -320 5056 R0
SYMATTR InstName R17
SYMATTR Value 1k
SYMBOL voltage -208 5024 R180
WINDOW 0 24 96 Left 2
WINDOW 3 24 16 Left 2
WINDOW 123 0 0 Left 0
WINDOW 39 0 0 Left 0
SYMATTR InstName V12
SYMATTR Value 5
SYMBOL nmos -352 5392 R0
SYMATTR InstName M26
SYMATTR Value 2N7002
SYMBOL nmos -176 5168 R0
SYMATTR InstName M27
SYMATTR Value 2N7002
SYMBOL res -144 5040 R0
SYMATTR InstName R18
SYMATTR Value 1k
SYMBOL nmos -320 3824 R0
SYMATTR InstName M28
SYMATTR Value 2N7002
SYMBOL res -288 3616 R0
SYMATTR InstName R19
SYMATTR Value 1k
SYMBOL voltage -176 3584 R180
WINDOW 0 24 96 Left 2
WINDOW 3 24 16 Left 2
WINDOW 123 0 0 Left 0
WINDOW 39 0 0 Left 0
SYMATTR InstName V13
SYMATTR Value 5
SYMBOL nmos -320 3952 R0
SYMATTR InstName M29
SYMATTR Value 2N7002
SYMBOL nmos -144 3728 R0
SYMATTR InstName M30
SYMATTR Value 2N7002
SYMBOL res -112 3600 R0
SYMATTR InstName R20
SYMATTR Value 1k
SYMBOL voltage 688 -352 R180
WINDOW 0 24 96 Left 2
WINDOW 3 24 16 Left 2
WINDOW 123 0 0 Left 0
WINDOW 39 0 0 Left 0
SYMATTR InstName V14
SYMATTR Value 5
SYMBOL res 672 -384 R0
SYMATTR InstName R21
SYMATTR Value 1k
SYMBOL nmos 544 -224 R0
SYMATTR InstName M31
SYMATTR Value 2N7002
SYMBOL nmos 544 -128 R0
SYMATTR InstName M32
SYMATTR Value 2N7002
SYMBOL nmos 720 -224 R0
SYMATTR InstName M33
SYMATTR Value 2N7002
SYMBOL nmos 720 -128 R0
SYMATTR InstName M34
SYMATTR Value 2N7002
SYMBOL nmos 1088 -128 R0
SYMATTR InstName M35
SYMATTR Value 2N7002
SYMBOL res 1120 -336 R0
SYMATTR InstName R22
SYMATTR Value 1k
SYMBOL voltage 1232 -368 R180
WINDOW 0 24 96 Left 2
WINDOW 3 24 16 Left 2
WINDOW 123 0 0 Left 0
WINDOW 39 0 0 Left 0
SYMATTR InstName V15
SYMATTR Value 5
SYMBOL nmos 1088 0 R0
SYMATTR InstName M36
SYMATTR Value 2N7002
SYMBOL nmos 1264 -224 R0
SYMATTR InstName M37
SYMATTR Value 2N7002
SYMBOL res 1296 -352 R0
SYMATTR InstName R23
SYMATTR Value 1k
SYMBOL voltage 832 448 R180
WINDOW 0 24 96 Left 2
WINDOW 3 24 16 Left 2
WINDOW 123 0 0 Left 0
WINDOW 39 0 0 Left 0
SYMATTR InstName V16
SYMATTR Value 5
SYMBOL res 816 432 R0
SYMATTR InstName R24
SYMATTR Value 1k
SYMBOL nmos 688 592 R0
SYMATTR InstName M38
SYMATTR Value 2N7002
SYMBOL nmos 688 688 R0
SYMATTR InstName M39
SYMATTR Value 2N7002
SYMBOL nmos 864 592 R0
SYMATTR InstName M40
SYMATTR Value 2N7002
SYMBOL nmos 864 688 R0
SYMATTR InstName M41
SYMATTR Value 2N7002
SYMBOL nmos 1024 576 R0
SYMATTR InstName M42
SYMATTR Value 2N7002
SYMBOL res 1056 464 R0
SYMATTR InstName R25
SYMATTR Value 1k
SYMBOL voltage 1504 464 R180
WINDOW 0 24 96 Left 2
WINDOW 3 24 16 Left 2
WINDOW 123 0 0 Left 0
WINDOW 39 0 0 Left 0
SYMATTR InstName V17
SYMATTR Value 5
SYMBOL res 1488 448 R0
SYMATTR InstName R26
SYMATTR Value 1k
SYMBOL nmos 1360 608 R0
SYMATTR InstName M43
SYMATTR Value 2N7002
SYMBOL nmos 1360 704 R0
SYMATTR InstName M44
SYMATTR Value 2N7002
SYMBOL nmos 1536 608 R0
SYMATTR InstName M45
SYMATTR Value 2N7002
SYMBOL nmos 1536 704 R0
SYMATTR InstName M46
SYMATTR Value 2N7002
SYMBOL nmos 1696 592 R0
SYMATTR InstName M47
SYMATTR Value 2N7002
SYMBOL res 1728 480 R0
SYMATTR InstName R27
SYMATTR Value 1k
SYMBOL voltage 2192 496 R180
WINDOW 0 24 96 Left 2
WINDOW 3 24 16 Left 2
WINDOW 123 0 0 Left 0
WINDOW 39 0 0 Left 0
SYMATTR InstName V18
SYMATTR Value 5
SYMBOL res 2176 480 R0
SYMATTR InstName R28
SYMATTR Value 1k
SYMBOL nmos 2048 640 R0
SYMATTR InstName M48
SYMATTR Value 2N7002
SYMBOL nmos 2048 736 R0
SYMATTR InstName M49
SYMATTR Value 2N7002
SYMBOL nmos 2224 640 R0
SYMATTR InstName M50
SYMATTR Value 2N7002
SYMBOL nmos 2224 736 R0
SYMATTR InstName M51
SYMATTR Value 2N7002
SYMBOL voltage 3056 336 R180
WINDOW 0 24 96 Left 2
WINDOW 3 24 16 Left 2
WINDOW 123 0 0 Left 0
WINDOW 39 0 0 Left 0
SYMATTR InstName V19
SYMATTR Value 5
SYMBOL res 3040 320 R0
SYMATTR InstName R29
SYMATTR Value 1k
SYMBOL res 3184 320 R0
SYMATTR InstName R30
SYMATTR Value 1k
SYMBOL nmos 3008 448 R0
SYMATTR InstName M52
SYMATTR Value 2N7002
SYMBOL nmos 3008 544 R0
SYMATTR InstName M53
SYMATTR Value 2N7002
SYMBOL nmos 3008 640 R0
SYMATTR InstName M54
SYMATTR Value 2N7002
SYMBOL nmos 3008 736 R0
SYMATTR InstName M55
SYMATTR Value 2N7002
SYMBOL nmos 3152 432 R0
SYMATTR InstName M56
SYMATTR Value 2N7002
SYMBOL voltage 1088 1344 R180
WINDOW 0 24 96 Left 2
WINDOW 3 24 16 Left 2
WINDOW 123 0 0 Left 0
WINDOW 39 0 0 Left 0
SYMATTR InstName V20
SYMATTR Value 5
SYMBOL res 1072 1328 R0
SYMATTR InstName R31
SYMATTR Value 1k
SYMBOL res 1184 1328 R0
SYMATTR InstName R32
SYMATTR Value 1k
SYMBOL nmos 768 1472 R0
SYMATTR InstName M57
SYMATTR Value 2N7002
SYMBOL nmos 928 1472 R0
SYMATTR InstName M58
SYMATTR Value 2N7002
SYMBOL nmos 1072 1472 R0
SYMATTR InstName M59
SYMATTR Value 2N7002
SYMBOL nmos 1232 1472 R0
SYMATTR InstName M60
SYMATTR Value 2N7002
SYMBOL nmos 1344 1392 R0
SYMATTR InstName M61
SYMATTR Value 2N7002
SYMBOL voltage 2224 1280 R180
WINDOW 0 24 96 Left 2
WINDOW 3 24 16 Left 2
WINDOW 123 0 0 Left 0
WINDOW 39 0 0 Left 0
SYMATTR InstName V22
SYMATTR Value 5
SYMBOL res 2208 1264 R0
SYMATTR InstName R34
SYMATTR Value 1k
SYMBOL nmos 2176 1392 R0
SYMATTR InstName M66
SYMATTR Value 2N7002
SYMBOL nmos 2176 1488 R0
SYMATTR InstName M67
SYMATTR Value 2N7002
SYMBOL nmos 2176 1584 R0
SYMATTR InstName M68
SYMATTR Value 2N7002
SYMBOL nmos 2176 1680 R0
SYMATTR InstName M69
SYMATTR Value 2N7002
SYMBOL voltage 2576 1280 R180
WINDOW 0 24 96 Left 2
WINDOW 3 24 16 Left 2
WINDOW 123 0 0 Left 0
WINDOW 39 0 0 Left 0
SYMATTR InstName V23
SYMATTR Value 5
SYMBOL res 2560 1264 R0
SYMATTR InstName R35
SYMATTR Value 1k
SYMBOL nmos 2528 1392 R0
SYMATTR InstName M70
SYMATTR Value 2N7002
SYMBOL nmos 2528 1488 R0
SYMATTR InstName M71
SYMATTR Value 2N7002
SYMBOL nmos 2528 1584 R0
SYMATTR InstName M72
SYMATTR Value 2N7002
SYMBOL nmos 2528 1680 R0
SYMATTR InstName M73
SYMATTR Value 2N7002
SYMBOL voltage 3008 1280 R180
WINDOW 0 24 96 Left 2
WINDOW 3 24 16 Left 2
WINDOW 123 0 0 Left 0
WINDOW 39 0 0 Left 0
SYMATTR InstName V24
SYMATTR Value 5
SYMBOL res 2992 1264 R0
SYMATTR InstName R36
SYMATTR Value 1k
SYMBOL nmos 2960 1392 R0
SYMATTR InstName M74
SYMATTR Value 2N7002
SYMBOL nmos 2960 1488 R0
SYMATTR InstName M75
SYMATTR Value 2N7002
SYMBOL nmos 2960 1584 R0
SYMATTR InstName M76
SYMATTR Value 2N7002
SYMBOL nmos 2960 1680 R0
SYMATTR InstName M77
SYMATTR Value 2N7002
SYMBOL voltage 3552 1232 R180
WINDOW 0 24 96 Left 2
WINDOW 3 24 16 Left 2
WINDOW 123 0 0 Left 0
WINDOW 39 0 0 Left 0
SYMATTR InstName V25
SYMATTR Value 5
SYMBOL res 3536 1216 R0
SYMATTR InstName R37
SYMATTR Value 1k
SYMBOL res 3680 1216 R0
SYMATTR InstName R38
SYMATTR Value 1k
SYMBOL nmos 3504 1344 R0
SYMATTR InstName M78
SYMATTR Value 2N7002
SYMBOL nmos 3504 1440 R0
SYMATTR InstName M79
SYMATTR Value 2N7002
SYMBOL nmos 3504 1536 R0
SYMATTR InstName M80
SYMATTR Value 2N7002
SYMBOL nmos 3504 1728 R0
WINDOW 3 56 60 Left 2
SYMATTR Value 2N7002
SYMATTR InstName M82
SYMBOL nmos 3504 1824 R0
SYMATTR InstName M83
SYMATTR Value 2N7002
SYMBOL nmos 3664 1344 R0
SYMATTR InstName M84
SYMATTR Value 2N7002
SYMBOL voltage 4144 1376 R180
WINDOW 0 24 96 Left 2
WINDOW 3 24 16 Left 2
WINDOW 123 0 0 Left 0
WINDOW 39 0 0 Left 0
SYMATTR InstName V26
SYMATTR Value 5
SYMBOL res 4128 1360 R0
SYMATTR InstName R39
SYMATTR Value 1k
SYMBOL nmos 4000 1520 R0
SYMATTR InstName M85
SYMATTR Value 2N7002
SYMBOL nmos 4000 1616 R0
SYMATTR InstName M86
SYMATTR Value 2N7002
SYMBOL nmos 4176 1520 R0
SYMATTR InstName M87
SYMATTR Value 2N7002
SYMBOL nmos 4176 1616 R0
SYMATTR InstName M88
SYMATTR Value 2N7002
SYMBOL nmos 4336 1504 R0
SYMATTR InstName M89
SYMATTR Value 2N7002
SYMBOL res 4368 1392 R0
SYMATTR InstName R40
SYMATTR Value 1k
SYMBOL voltage 4816 1392 R180
WINDOW 0 24 96 Left 2
WINDOW 3 24 16 Left 2
WINDOW 123 0 0 Left 0
WINDOW 39 0 0 Left 0
SYMATTR InstName V27
SYMATTR Value 5
SYMBOL res 4800 1376 R0
SYMATTR InstName R41
SYMATTR Value 1k
SYMBOL nmos 4672 1536 R0
SYMATTR InstName M90
SYMATTR Value 2N7002
SYMBOL nmos 4672 1632 R0
SYMATTR InstName M91
SYMATTR Value 2N7002
SYMBOL nmos 4848 1536 R0
SYMATTR InstName M92
SYMATTR Value 2N7002
SYMBOL nmos 4848 1632 R0
SYMATTR InstName M93
SYMATTR Value 2N7002
SYMBOL voltage 1920 4400 R180
WINDOW 0 24 96 Left 2
WINDOW 3 24 16 Left 2
WINDOW 123 0 0 Left 0
WINDOW 39 0 0 Left 0
SYMATTR InstName V28
SYMATTR Value 5
SYMBOL res 1904 4384 R0
SYMATTR InstName R42
SYMATTR Value 1k
SYMBOL nmos 1776 4544 R0
SYMATTR InstName M94
SYMATTR Value 2N7002
SYMBOL nmos 1776 4640 R0
SYMATTR InstName M95
SYMATTR Value 2N7002
SYMBOL nmos 1952 4544 R0
SYMATTR InstName M96
SYMATTR Value 2N7002
SYMBOL nmos 1952 4640 R0
SYMATTR InstName M97
SYMATTR Value 2N7002
SYMBOL nmos 2112 4528 R0
SYMATTR InstName M98
SYMATTR Value 2N7002
SYMBOL res 2144 4416 R0
SYMATTR InstName R43
SYMATTR Value 1k
SYMBOL voltage 1904 3056 R180
WINDOW 0 24 96 Left 2
WINDOW 3 24 16 Left 2
WINDOW 123 0 0 Left 0
WINDOW 39 0 0 Left 0
SYMATTR InstName V29
SYMATTR Value 5
SYMBOL res 1888 3024 R0
SYMATTR InstName R44
SYMATTR Value 1k
SYMBOL nmos 1808 3168 R0
SYMATTR InstName M99
SYMATTR Value 2N7002
SYMBOL nmos 1984 3168 R0
SYMATTR InstName M100
SYMATTR Value 2N7002
SYMBOL voltage 2384 3056 R180
WINDOW 0 24 96 Left 2
WINDOW 3 24 16 Left 2
WINDOW 123 0 0 Left 0
WINDOW 39 0 0 Left 0
SYMATTR InstName V30
SYMATTR Value 5
SYMBOL res 2368 3024 R0
SYMATTR InstName R45
SYMATTR Value 1k
SYMBOL nmos 2288 3168 R0
SYMATTR InstName M101
SYMATTR Value 2N7002
SYMBOL nmos 2464 3168 R0
SYMATTR InstName M102
SYMATTR Value 2N7002
SYMBOL voltage 3056 2976 R180
WINDOW 0 24 96 Left 2
WINDOW 3 24 16 Left 2
WINDOW 123 0 0 Left 0
WINDOW 39 0 0 Left 0
SYMATTR InstName V31
SYMATTR Value 5
SYMBOL res 3040 2944 R0
SYMATTR InstName R46
SYMATTR Value 1k
SYMBOL voltage 3568 3040 R180
WINDOW 0 24 96 Left 2
WINDOW 3 24 16 Left 2
WINDOW 123 0 0 Left 0
WINDOW 39 0 0 Left 0
SYMATTR InstName V32
SYMATTR Value 5
SYMBOL res 3552 3040 R0
SYMATTR InstName R47
SYMATTR Value 1k
SYMBOL res 3664 3040 R0
SYMATTR InstName R48
SYMATTR Value 1k
SYMBOL nmos 3472 3184 R0
SYMATTR InstName M106
SYMATTR Value 2N7002
SYMBOL nmos 3648 3184 R0
SYMATTR InstName M107
SYMATTR Value 2N7002
SYMBOL nmos 3808 3152 R0
SYMATTR InstName M108
SYMATTR Value 2N7002
SYMBOL nmos 2960 3120 R0
SYMATTR InstName M103
SYMATTR Value 2N7002
SYMBOL nmos 3136 3120 R0
SYMATTR InstName M104
SYMATTR Value 2N7002
SYMBOL voltage 2640 4416 R180
WINDOW 0 24 96 Left 2
WINDOW 3 24 16 Left 2
WINDOW 123 0 0 Left 0
WINDOW 39 0 0 Left 0
SYMATTR InstName V33
SYMATTR Value 5
SYMBOL res 2624 4400 R0
SYMATTR InstName R49
SYMATTR Value 1k
SYMBOL nmos 2496 4560 R0
SYMATTR InstName M109
SYMATTR Value 2N7002
SYMBOL nmos 2496 4656 R0
SYMATTR InstName M110
SYMATTR Value 2N7002
SYMBOL nmos 2672 4560 R0
SYMATTR InstName M111
SYMATTR Value 2N7002
SYMBOL nmos 2672 4656 R0
SYMATTR InstName M112
SYMATTR Value 2N7002
SYMBOL voltage 3152 5504 R180
WINDOW 0 24 96 Left 2
WINDOW 3 24 16 Left 2
WINDOW 123 0 0 Left 0
WINDOW 39 0 0 Left 0
SYMATTR InstName V37
SYMATTR Value 5
SYMBOL res 3136 5504 R0
SYMATTR InstName R53
SYMATTR Value 1k
SYMBOL res 3248 5504 R0
SYMATTR InstName R54
SYMATTR Value 1k
SYMBOL nmos 3056 5648 R0
SYMATTR InstName M117
SYMATTR Value 2N7002
SYMBOL nmos 3232 5648 R0
SYMATTR InstName M118
SYMATTR Value 2N7002
SYMBOL nmos 3392 5616 R0
SYMATTR InstName M119
SYMATTR Value 2N7002
SYMBOL nmos 2704 5520 R0
SYMATTR InstName M121
SYMATTR Value 2N7002
SYMBOL nmos 2704 5616 R0
SYMATTR InstName M122
SYMATTR Value 2N7002
SYMBOL voltage -64 1424 R180
WINDOW 0 24 96 Left 2
WINDOW 3 24 16 Left 2
WINDOW 123 0 0 Left 0
WINDOW 39 0 0 Left 0
SYMATTR InstName V38
SYMATTR Value 5
SYMBOL voltage 2752 5424 R180
WINDOW 0 24 96 Left 2
WINDOW 3 24 16 Left 2
WINDOW 123 0 0 Left 0
WINDOW 39 0 0 Left 0
SYMATTR InstName V4
SYMATTR Value 5
SYMBOL res 2736 5408 R0
SYMATTR InstName R3
SYMATTR Value 1k
SYMBOL nmos 2576 3568 R0
SYMATTR InstName M5
SYMATTR Value 2N7002
SYMBOL nmos 2576 3664 R0
SYMATTR InstName M6
SYMATTR Value 2N7002
SYMBOL res 2608 3456 R0
SYMATTR InstName R4
SYMATTR Value 1k
SYMBOL voltage 2624 3488 R180
WINDOW 0 24 96 Left 2
WINDOW 3 24 16 Left 2
WINDOW 123 0 0 Left 0
WINDOW 39 0 0 Left 0
SYMATTR InstName V5
SYMATTR Value 5
TEXT -400 528 Left 2 !.tran 1
TEXT 1240 -728 Left 2 ;Td1 20ns Td2 30ns Tc2 40ns Td3 70ns Tc3_1 60ns Tc3_2 90ns\nTd4 120ns Tc4 160ns Td5 170ns Td6 190ns
TEXT 1264 1600 Left 2 ;60ns

The netlist it stands for:
* MOSFET Testing.asc
M1 N007 N012 N013 N013 2N7002
R1 N009 N007 1k
V1 N009 0 5
V§A2 N012 0 5
M2 N013 N005 0 0 2N7002
V§B2 N045 0 5
M3 A2B1 N007 0 0 2N7002
R2 N009 A2B1 1k
M7 NAND N023 N025 N025 2N7002
R5 N021 NAND 1k
V8 N021 0 5
V§A3 N023 0 5
M8 N025 N005 0 0 2N7002
V§B3 N050 0 5
M9 A3B1 NAND 0 0 2N7002
R6 N021 A3B1 1k
M10 N002 N003 N004 N004 2N7002
R7 N001 N002 1k
V11 N001 0 5
V§A1 N003 0 5
M11 N004 N005 0 0 2N7002
V§B1 N005 0 5
M12 D1 N002 0 0 2N7002
R8 N001 D1 1k
M13 N022 N012 N048 N048 2N7002
R9 N046 N022 1k
V2 N046 0 5
M14 N048 N045 0 0 2N7002
M15 A2B2 N022 0 0 2N7002
R10 N046 A2B2 1k
M16 N044 N023 N055 N055 2N7002
R11 N049 N044 1k
V3 N049 0 5
M17 N055 N045 0 0 2N7002
M18 A3B2 N044 0 0 2N7002
R12 N049 A3B2 1k
M19 N011 N003 N043 N043 2N7002
R13 N039 N011 1k
V9 N039 0 5
M20 N043 N045 0 0 2N7002
M21 A1B2 N011 0 0 2N7002
R14 N038 A1B2 1k
M22 N047 N012 N064 N064 2N7002
R15 N059 N047 1k
V10 N059 0 5
M23 N064 N050 0 0 2N7002
M24 A2B3 N047 0 0 2N7002
R16 N059 A2B3 1k
M25 N066 N023 N067 N067 2N7002
R17 N065 N066 1k
V12 N065 0 5
M26 N067 N050 0 0 2N7002
M27 A3B3 N066 0 0 2N7002
R18 N065 A3B3 1k
M28 N024 N003 N058 N058 2N7002
R19 N057 N024 1k
V13 N057 0 5
M29 N058 N050 0 0 2N7002
M30 A1B3 N024 0 0 2N7002
R20 N057 A1B3 1k
V14 P001 0 5
R21 P001 D2 1k
M31 D2 A2B1 P002 P002 2N7002
M32 P002 A1B2 0 0 2N7002
M33 D2 N007 P003 P003 2N7002
M34 P003 N011 0 0 2N7002
M35 N008 A2B1 N010 N010 2N7002
R22 N006 N008 1k
V15 N006 0 5
M36 N010 A1B2 0 0 2N7002
M37 C2 N008 0 0 2N7002
R23 N006 C2 1k
V16 N015 0 5
R24 N015 3_1 1k
M38 3_1 A3B1 P004 P004 2N7002
M39 P004 A2B2 0 0 2N7002
M40 3_1 NAND P005 P005 2N7002
M41 P005 N022 0 0 2N7002
M42 N019 3_1 0 0 2N7002
R25 N015 N019 1k
V17 N017 0 5
R26 N017 3_2 1k
M43 3_2 3_1 P006 P006 2N7002
M44 P006 A1B3 0 0 2N7002
M45 3_2 N019 P007 P007 2N7002
M46 P007 N024 0 0 2N7002
M47 N020 3_2 0 0 2N7002
R27 N017 N020 1k
V18 N018 0 5
R28 N018 D3 1k
M48 D3 C2 P008 P008 2N7002
M49 P008 3_2 0 0 2N7002
M50 D3 N008 P009 P009 2N7002
M51 P009 N020 0 0 2N7002
V19 N014 0 5
R29 N014 N016 1k
R30 N014 C3_2 1k
M52 N016 C2 P010 P010 2N7002
M53 P010 A3B1 P011 P011 2N7002
M54 P011 A2B2 P012 P012 2N7002
M55 P012 A1B3 0 0 2N7002
M56 C3_2 N016 0 0 2N7002
V20 N030 0 5
R31 N030 N040 1k
R32 N030 N036 1k
M57 N040 A3B1 0 0 2N7002
M58 N040 A2B2 0 0 2N7002
M59 N040 A1B3 0 0 2N7002
M60 N040 C2 0 0 2N7002
M61 N036 N040 0 0 2N7002
V22 N027 0 5
R34 N027 N033 1k
M66 N033 NAND P013 P013 2N7002
M67 P013 N022 P014 P014 2N7002
M68 P014 A1B3 P015 P015 2N7002
M69 P015 N008 0 0 2N7002
V23 N028 0 5
R35 N028 N034 1k
M70 N034 NAND P016 P016 2N7002
M71 P016 A2B2 P017 P017 2N7002
M72 P017 N024 P018 P018 2N7002
M73 P018 N008 0 0 2N7002
V24 N029 0 5
R36 N029 N035 1k
M74 N035 A3B1 P019 P019 2N7002
M75 P019 N022 P020 P020 2N7002
M76 P020 N024 P021 P021 2N7002
M77 P021 N008 0 0 2N7002
V25 N026 0 5
R37 N026 N031 1k
R38 N026 C3_1 1k
M78 N031 N035 P022 P022 2N7002
M79 P022 N034 P023 P023 2N7002
M80 P023 N033 N042 N042 2N7002
M82 N042 N036 P024 P024 2N7002
M83 P024 N016 0 0 2N7002
M84 C3_1 N031 0 0 2N7002
V26 N032 0 5
R39 N032 4_1 1k
M85 4_1 C3_1 P025 P025 2N7002
M86 P025 A3B2 0 0 2N7002
M87 4_1 N031 P026 P026 2N7002
M88 P026 N044 0 0 2N7002
M89 N041 4_1 0 0 2N7002
R40 N032 N041 1k
V27 N037 0 5
R41 N037 D4 1k
M90 D4 4_1 P027 P027 2N7002
M91 P027 A2B3 0 0 2N7002
M92 D4 N041 P028 P028 2N7002
M93 P028 N047 0 0 2N7002
V28 N060 0 5
R42 N060 N062 1k
M94 N062 C3_2 P029 P029 2N7002
M95 P029 A3B3 0 0 2N7002
M96 N062 N016 P030 P030 2N7002
M97 P030 N066 0 0 2N7002
M98 N063 N062 0 0 2N7002
R43 N060 N063 1k
V29 P031 0 5
R44 P031 N052 1k
M99 N052 A2B3 0 0 2N7002
M100 N052 A3B2 0 0 2N7002
V30 P032 0 5
R45 P032 N053 1k
M101 N053 N031 0 0 2N7002
M102 N053 N052 0 0 2N7002
V31 P033 0 5
R46 P033 C4_1 1k
V32 N051 0 5
R47 N051 N054 1k
R48 N051 C4 1k
M106 N054 C4_1 0 0 2N7002
M107 N054 N053 0 0 2N7002
M108 C4 N054 0 0 2N7002
M103 C4_1 C3_1 0 0 2N7002
M104 C4_1 N056 0 0 2N7002
V33 N061 0 5
R49 N061 D5 1k
M109 D5 N062 P034 P034 2N7002
M110 P034 C4 0 0 2N7002
M111 D5 N063 P035 P035 2N7002
M112 P035 N054 0 0 2N7002
V37 N069 0 5
R53 N069 N071 1k
R54 N069 D6 1k
M117 N071 C3_2 0 0 2N7002
M118 N071 N070 0 0 2N7002
M119 D6 N071 0 0 2N7002
M121 N070 C4 P036 P036 2N7002
M122 P036 A3B3 0 0 2N7002
V38 N038 0 5
V4 N068 0 5
R3 N068 N070 1k
M5 N056 A3B2 P037 P037 2N7002
M6 P037 A2B3 0 0 2N7002
R4 P038 N056 1k
V5 P038 0 5
.model NMOS NMOS
.model PMOS PMOS
.lib standard.mos
.tran 1
* Td1 20ns Td2 30ns Tc2 40ns Td3 70ns Tc3_1 60ns Tc3_2 90ns
* Td4 120ns Tc4 160ns Td5 170ns Td6 190ns
* 60ns
.backanno
.end